# Altium schematic sheet 03 METER&PWM&KEY.SchDoc
size A3
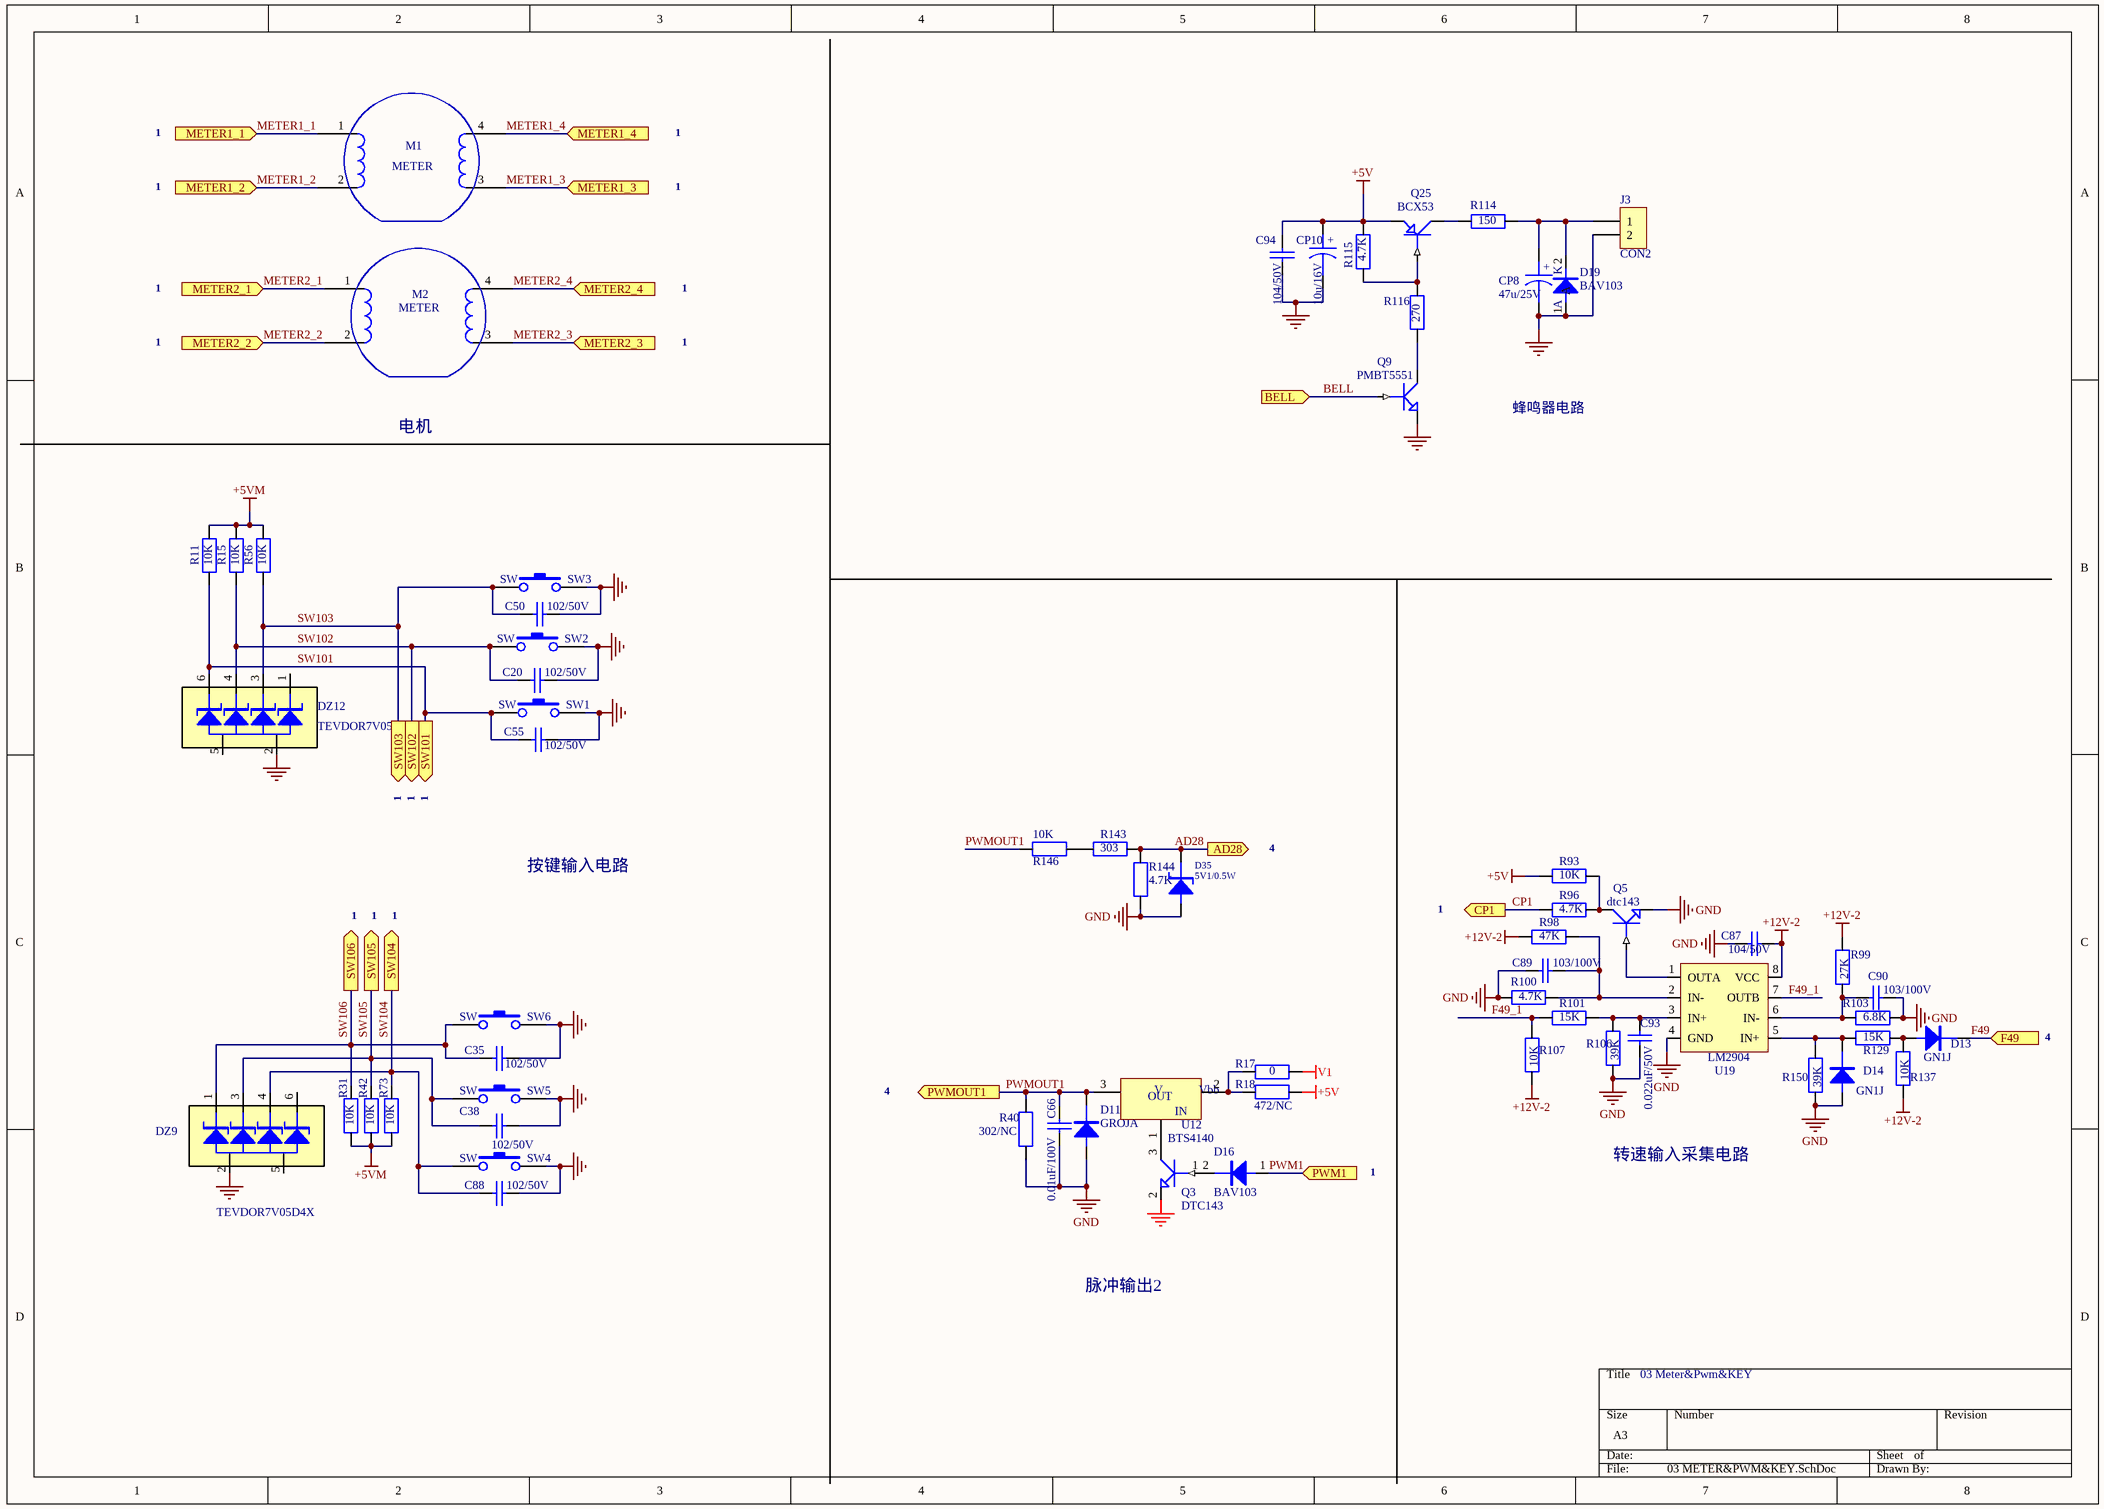
[diagram p0: 03 METER&PWM&KEY.SchDoc]

## Parts
C20  102/50V  [CR0805]
C35  102/50V  [CR0805]
C38  102/50V  [CR0805]
C50  102/50V  [CR0805]
C55  102/50V  [CR0805]
C66  0.01uF/100V  [CR0805]
C87  104/50V  [CR0805]
C88  102/50V  [CR0805]
C89  103/100V  [CR0805]
C90  103/100V  [CR0805]
C93  0.022uF/50V  [CR0805]
C94  104/50V  [CR0805]
CP8  47u/25V  [10uF/25V]
CP10  10u/16V  [CE1206]
D11  GROJA  [SMA]
D13  GN1J  [SMA]
D14  GN1J  [SMA]
D16  BAV103  [SOD-80C]
D19  BAV103  [SOD-80C]
D35  5V1/0.5W  [SOD-80C]
DZ9  TEVDOR7V05D4X  [SOT-457]
DZ12  TEVDOR7V05D4X  [SOT-457]
J3  CON2  [DIP 1X2 2.5mm]
M1  METER  [METER2]
M2  METER  [METER2]
Q3  DTC143  [SOT23]
Q5  dtc143  [SOT-23]
Q9  PMBT5551  [SMT3]
Q25  BCX53  [SOT89]
R11  10K  [CR0805]
R15  10K  [CR0805]
R17  0  [CR1206]
R18  472/NC  [CR1206]
R31  10K  [CR0805]
R40  302/NC  [CR0805]
R42  10K  [CR0805]
R56  10K  [CR0805]
R73  10K  [CR0805]
R93  10K  [CR0805]
R96  4.7K  [CR0805]
R98  47K  [CR0805]
R99  27K  [CR0805]
R100  4.7K  [CR0805]
R101  15K  [CR0805]
R103  6.8K  [CR0805]
R106  39K  [CR0805]
R107  10K  [CR0805]
R114  150  [CR0805]
R115  4.7K  [CR0805]
R116  270  [CR0805]
R129  15K  [CR0805]
R137  10K  [CR0805]
R143  303  [CR0805]
R144  4.7K  [CR0805]
R146  10K  [CR1206]
R150  39K  [CR0805]
SW1  SW  [Switch-1]
SW2  SW  [Switch-1]
SW3  SW  [Switch-1]
SW4  SW  [Switch-1]
SW5  SW  [Switch-1]
SW6  SW  [Switch-1]
U12  BTS4140  [SOT-223]
U19  LM2904  [SO-8]

## Ports
AD28 (out), BELL (in), CP1 (out), F49 (in), METER1_1 (in), METER1_2 (in), METER1_3 (in), METER1_4 (in), METER2_1 (in), METER2_2 (in), METER2_3 (in), METER2_4 (in), PWM1 (in), PWMOUT1 (out), SW101 (out), SW102 (out), SW103 (out), SW104 (out), SW105 (out), SW106 (out)

## Nets
+5V: C94.2 CP10.1 Q25.3(E) R18.2 R93.2 R115.1
+5VM: R11.1 R15.1 R31.2 R42.2 R56.1 R73.2
+12V-2: C87.2 R98.1 R99.2 R107.1 R137.1 U19.8(VCC)
GND: C20.1 C35.1 C38.2 C50.1 C55.1 C66.2 C87.1 C88.1 C89.2 C90.2 C93.1 C94.1 CP8.2 CP10.2 D11.1(A) D14.1(A) D19.1(A) D35.2(K) DZ9.2 DZ12.2 J3.2 Q3.2(gnd) Q5.3(E) Q9.1(E) R40.1 R100.2 R103.2 R106.1 R144.1 R150.1 SW1.2 SW2.2 SW3.2 SW4.2 SW5.2 SW6.2 U19.4(GND)
V1: R17.2
AD28: D35.1(A) R143.2 R144.2 ; port AD28
BELL: Q9.2(B) ; port BELL
CP1: R96.2 ; port CP1
F49: D13.2(K) ; port F49
F49_1: R101.1 R107.2 U19.7(OUTB)
METER1_1: M1.1 ; port METER1_1
METER1_2: M1.2 ; port METER1_2
METER1_3: M1.3 ; port METER1_3
METER1_4: M1.4 ; port METER1_4
METER2_1: M2.1 ; port METER2_1
METER2_2: M2.2 ; port METER2_2
METER2_3: M2.3 ; port METER2_3
METER2_4: M2.4 ; port METER2_4
PWM1: D16.1(A) ; port PWM1
PWMOUT1: C66.1 D11.2(K) R40.2 R146.1 U12.3(VOUT) ; port PWMOUT1
SW101: C55.2 DZ12.6 R11.2 SW1.1 ; port SW101
SW102: C20.2 DZ12.4 R15.2 SW2.1 ; port SW102
SW103: C50.2 DZ12.3 R56.2 SW3.1 ; port SW103
SW104: C88.2 DZ9.4 R73.1 SW4.1 ; port SW104
SW105: C38.1 DZ9.3 R42.1 SW5.1 ; port SW105
SW106: C35.2 DZ9.1 R31.1 SW6.1 ; port SW106
NetC89_1: C89.1 R98.2 R100.1 U19.2(IN-)
NetC90_1: C90.1 R99.1 R103.1 U19.6(IN-)
NetC93_2: C93.2 R101.2 R106.2 U19.3(IN+)
NetCP8_1: CP8.1 D19.2(K) J3.1 R114.1
NetD13_1: D13.1(A) R129.2 R137.2
NetD14_2: D14.2(K) R129.1 R150.2 U19.5(IN+)
NetD16_2: D16.2(K) Q3.1(in)
NetQ3_3: Q3.3(out) U12.1(IN)
NetQ5_1: Q5.1(B) U19.1(OUTA)
NetQ5_2: Q5.2(C) R93.1 R96.1
NetQ9_3: Q9.3(C) R116.1
NetQ25_1: Q25.1(B) R115.2 R116.2
NetQ25_2: Q25.2(C) R114.2
NetR17_1: R17.1 R18.1 U12.2(Vbb) U12.4(Vbb)
NetR143_1: R143.1 R146.2

Not connected (* = marked no-connect by the designer): DZ9 5 6; DZ12 1 5

## Notes on the sheet
- 1
- 电机
- 蜂鸣器电路
- 4
- 按键输入电路
- 转速输入采集电路
- 脉冲输出2
- 03 Meter&Pwm&KEY
- (in symbol BTS4140) V; OUT
- (in symbol CAPACITOR POL) +

## Library data of the parts
C20 C35 C38 C50 C55 C66 C88 C93 = CAP: Capacitor
C87 C89 C90 C94 = CAP: 贴片电容
CP8 CP10 = CAPACITOR POL: Capacitor
D11 D13 D14 D16 = DIODE: 二极管
D19 = GN1J: 二极管
D35 = DW: 稳压二极管
DZ9 DZ12 = BZA456G: 二极管排
J3 = CON2: 连接器-2PIN
Q3 Q9 = DTC143: NPN; HelpURL: G:\资料\规格书\二三极管\dtc143ee.pdf
Q5 = NPN1: 贴片三极管
Q25 = PNP1: 贴片三极管
R11 R15 R17 R18 R31 R40 R42 R56 R73 R93 R96 R98-R101 R103 R106 R107 R114-R116 R129 R137 R143 R144 R146 R150 = RES: 贴片电阻
SW1-SW6 = SW-PB
U12 = BTS4140: IC-单通道功率开关
U19 = LM2904: IC-双路运放